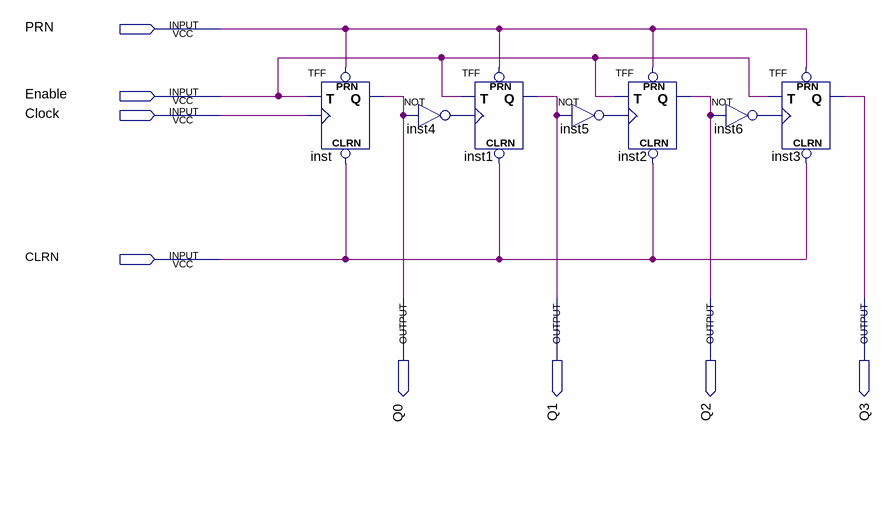
[diagram p0: schematic sheet]
// Quartus schematic lab10step3a.bdf as structural Verilog: 7 symbols, 8 pins
module lab10step3a (
  input  PRN,
  input  Enable,
  input  Clock,
  input  CLRN,
  output Q0,
  output Q1,
  output Q2,
  output Q3
);

  wire inst4_out, inst5_out, inst6_out;

  TFF inst (.PRN(PRN), .CLRN(CLRN), .T(Enable), .CLK(Clock), .Q(Q0));
  not inst4 (inst4_out, Q0);
  TFF inst1 (.PRN(PRN), .CLRN(CLRN), .T(Enable), .CLK(inst4_out), .Q(Q1));
  not inst5 (inst5_out, Q1);
  TFF inst2 (.PRN(PRN), .CLRN(CLRN), .T(Enable), .CLK(inst5_out), .Q(Q2));
  not inst6 (inst6_out, Q2);
  TFF inst3 (.PRN(PRN), .CLRN(CLRN), .T(Enable), .CLK(inst6_out), .Q(Q3));
endmodule
